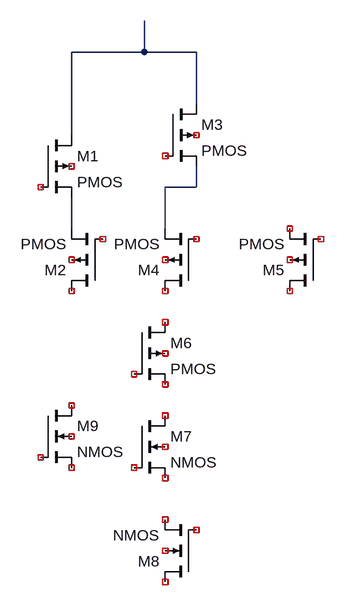
[diagram p0: schematic Draft1.asc]
Draft1.asc, the LTspice schematic file:
Version 4
SHEET 1 880 824
WIRE 352 -96 352 -144
WIRE 352 -96 240 -96
WIRE 432 -96 352 -96
WIRE 432 -16 432 -96
WIRE 240 32 240 -96
WIRE 432 112 432 80
WIRE 432 112 384 112
WIRE 240 176 240 128
WIRE 384 176 384 112
SYMBOL pmos4 192 32 R0
SYMATTR InstName M1
SYMBOL pmos4 288 272 R180
SYMATTR InstName M2
SYMBOL pmos4 384 -16 R0
SYMATTR InstName M3
SYMBOL pmos4 432 272 R180
SYMATTR InstName M4
SYMBOL pmos4 624 272 R180
SYMATTR InstName M5
SYMBOL pmos4 336 320 R0
SYMATTR InstName M6
SYMBOL nmos4 336 464 R0
SYMATTR InstName M7
SYMBOL nmos4 432 720 R180
SYMATTR InstName M8
SYMBOL nmos4 192 448 R0
SYMATTR InstName M9

The netlist it stands for:
* Draft1.asc
M1 N001 NC_01 N003 NC_02 PMOS
M2 NC_03 NC_04 N003 NC_05 PMOS
M3 N001 NC_06 N002 NC_07 PMOS
M4 NC_08 NC_09 N002 NC_10 PMOS
M5 NC_11 NC_12 NC_13 NC_14 PMOS
M6 NC_15 NC_16 NC_17 NC_18 PMOS
M7 NC_19 NC_20 NC_21 NC_22 NMOS
M8 NC_23 NC_24 NC_25 NC_26 NMOS
M9 NC_27 NC_28 NC_29 NC_30 NMOS
.model NMOS NMOS
.model PMOS PMOS
.lib standard.mos
.backanno
.end